# Altium schematic sheet IPO1_V0.01.SchDoc
size A3; Value: 13nH
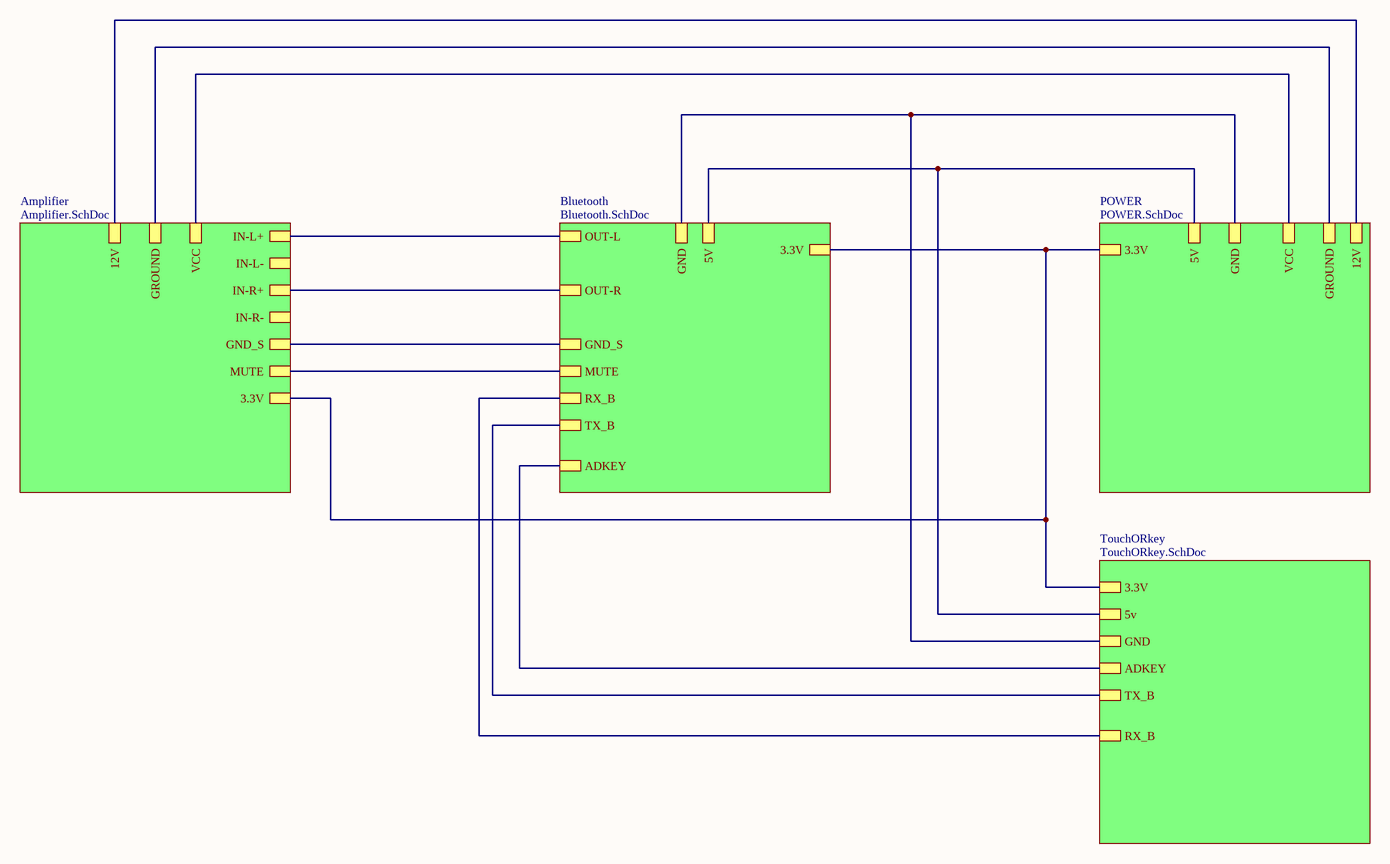
[diagram p0: IPO1_V0.01.SchDoc]

## Sub-sheets
Amplifier = Amplifier.SchDoc: IN-L+, IN-L-, IN-R+, IN-R-, MUTE, VCC, GROUND, GND_S, 3.3V, 12V
Bluetooth = Bluetooth.SchDoc: OUT-L, OUT-R, 3.3V, GND_S, GND, 5V, MUTE, RX_B, TX_B, ADKEY
POWER = POWER.SchDoc: 3.3V, GND, 5V, VCC, GROUND, 12V
TouchORkey = TouchORkey.SchDoc: ADKEY, 3.3V, 5v, GND, TX_B, RX_B

## Nets
(unnamed): sheet Amplifier/IN-L+, sheet Bluetooth/OUT-L
(unnamed): sheet Amplifier/IN-R+, sheet Bluetooth/OUT-R
(unnamed): sheet Amplifier/MUTE, sheet Bluetooth/MUTE
(unnamed): sheet Amplifier/VCC, sheet POWER/VCC
(unnamed): sheet Amplifier/GROUND, sheet POWER/GROUND
(unnamed): sheet Amplifier/GND_S, sheet Bluetooth/GND_S
(unnamed): sheet Amplifier/3.3V, sheet Bluetooth/3.3V, sheet POWER/3.3V, sheet TouchORkey/3.3V
(unnamed): sheet Amplifier/12V, sheet POWER/12V
(unnamed): sheet Bluetooth/GND, sheet POWER/GND, sheet TouchORkey/GND
(unnamed): sheet Bluetooth/5V, sheet POWER/5V, sheet TouchORkey/5v
(unnamed): sheet Bluetooth/RX_B, sheet TouchORkey/RX_B
(unnamed): sheet Bluetooth/TX_B, sheet TouchORkey/TX_B
(unnamed): sheet Bluetooth/ADKEY, sheet TouchORkey/ADKEY

## Notes on the sheet
- Title
- Size:
- Date:
- A3
- Number:
- Time:
- Revision:
- Sheet
- of
- File: